# EasyEDA schematic 4.64.json
TITLE: Sheet_1; REV: 1.0; Date: 2020-11-18; Sheet: 1/1; Drawn By: Gökbey Keskin; Company: Your Company
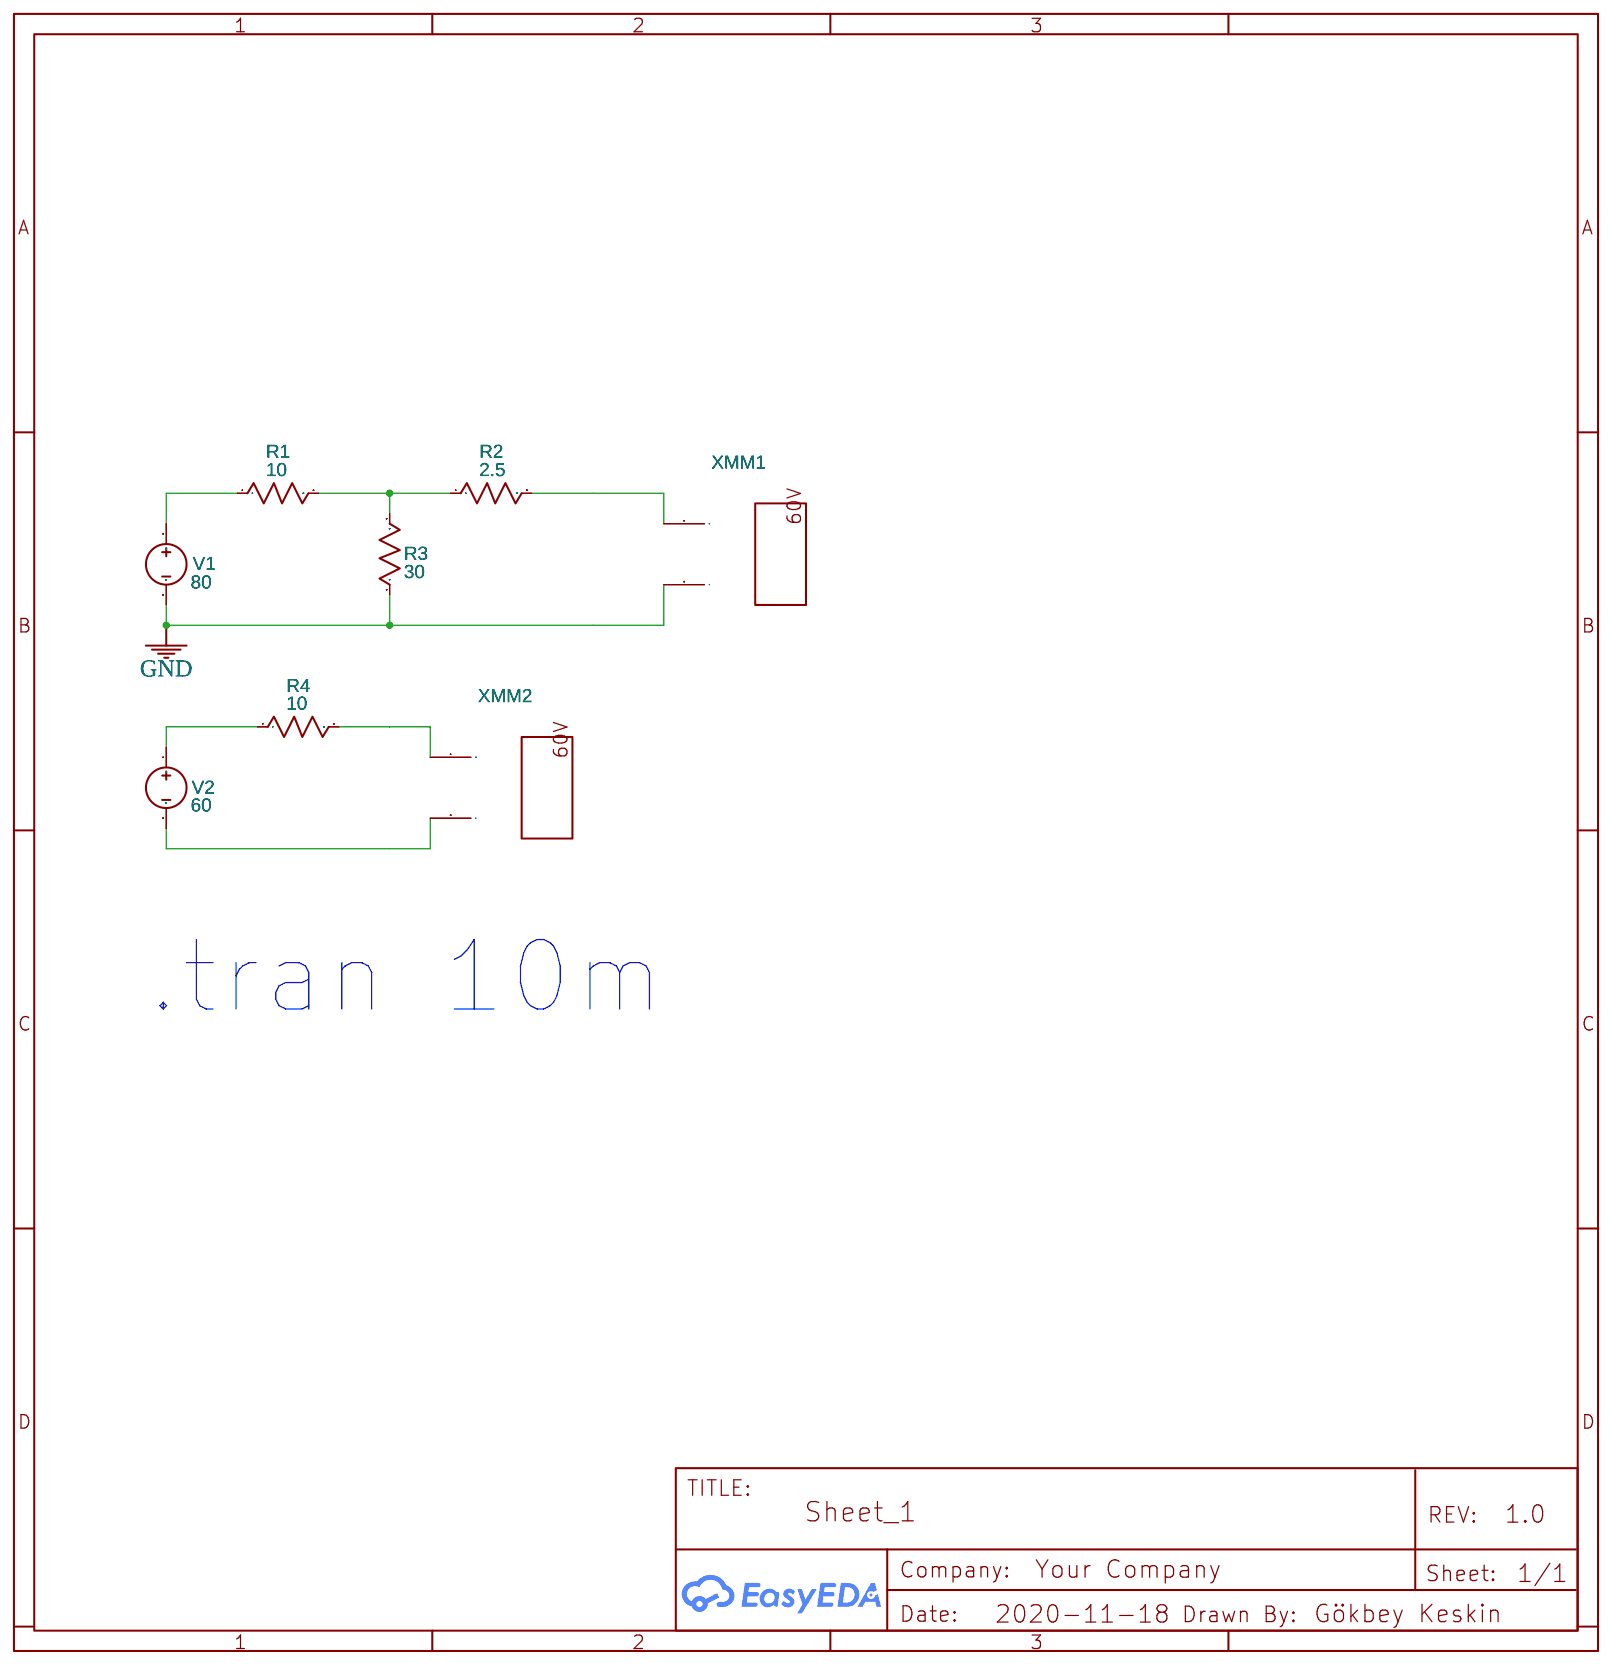
[diagram p0: schematic sheet]

## Parts
R1  10  [AXIAL-0.3]
R2  2.5  [AXIAL-0.3]
R3  30  [AXIAL-0.3]
R4  10  [AXIAL-0.3]
V1  80  [HDR1X2]
V2  60  [HDR1X2]
XMM1  Multimeter
XMM2  Multimeter

## Library data of the parts
R1-R4 = Resistor_US: Resistance: 1k; Contributor: EasyEDA; Supplier: YUJING
V1 V2 = VDC: Contributor: EasyEDA; sim: true
XMM1 XMM2 = MULTIMETER: Supplier: LCSC; Multimeter Type: Voltmeter; Power Type: AC; Voltmeter resistance: 10μ; Ammeter resistance: 1G; NameDisplay: 0; Contributor: EasyEDA; sim: true

## Nets
GND: R3.1 V1.2 XMM1.2(I)
Net-(R1-1): R1.1 V1.1
Net-(R1-2): R1.2 R2.1 R3.2
Net-(R2-2): R2.2 XMM1.1(+)
Net-(R4-1): R4.1 V2.1
Net-(R4-2): R4.2 XMM2.1(+)
Net-(V2-2): V2.2 XMM2.2(I)

## Notes on the sheet
- .tran 10m
